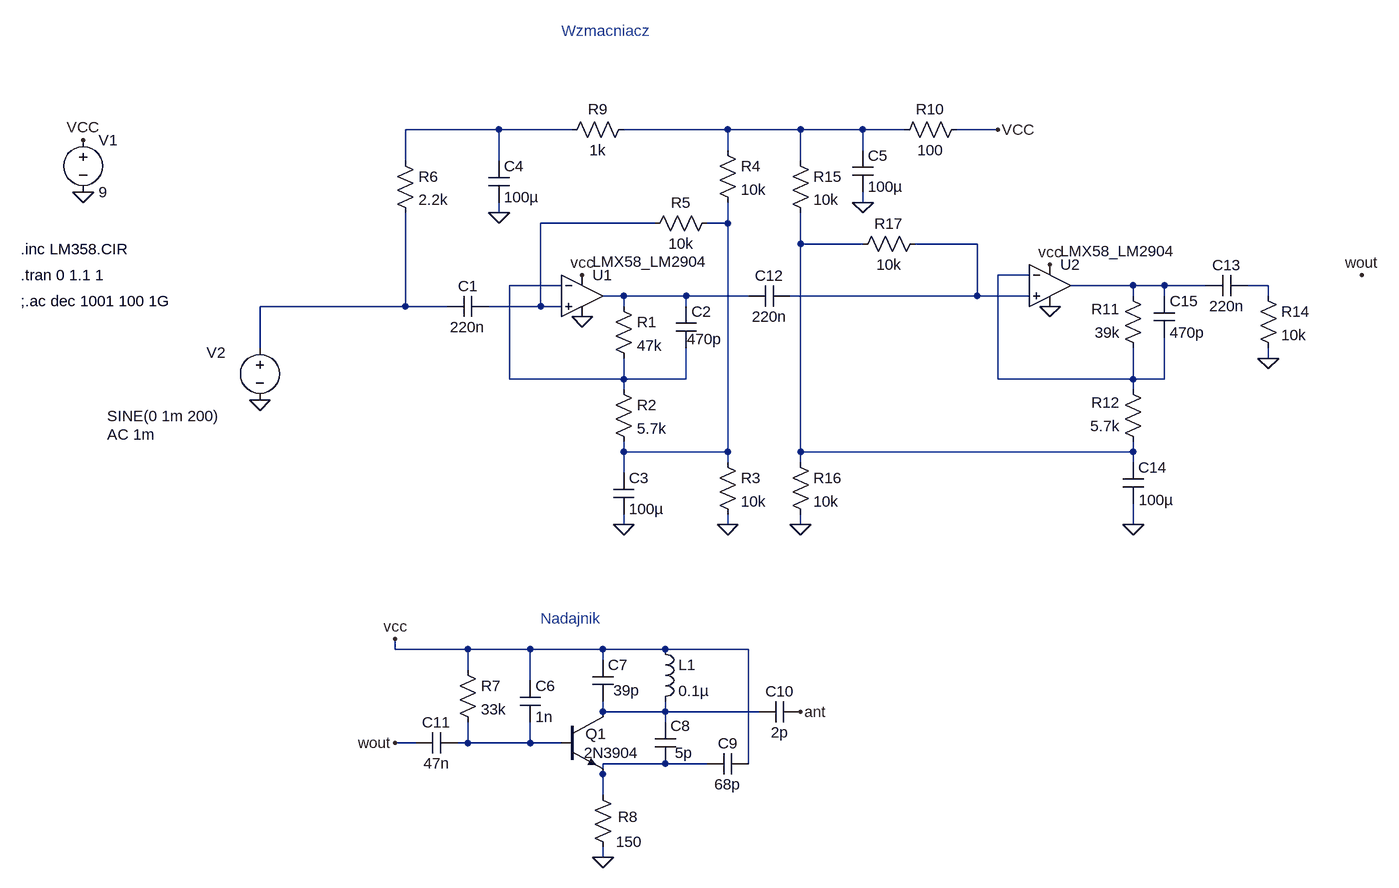
[diagram p0: schematic nadajnik.asc]
nadajnik.asc, the LTspice schematic file:
Version 4
SHEET 1 1900 1576
WIRE 496 336 352 336
WIRE 608 336 496 336
WIRE 848 336 688 336
WIRE 960 336 848 336
WIRE 1056 336 960 336
WIRE 1120 336 1056 336
WIRE 1264 336 1200 336
WIRE 848 368 848 336
WIRE 1056 368 1056 336
WIRE 352 384 352 336
WIRE 496 384 496 336
WIRE 960 384 960 336
WIRE 1056 448 1056 432
WIRE 496 464 496 448
WIRE 736 480 560 480
WIRE 848 480 848 448
WIRE 848 480 816 480
WIRE 960 512 960 464
WIRE 1056 512 960 512
WIRE 1232 512 1136 512
WIRE 1312 560 1264 560
WIRE 592 576 512 576
WIRE 1472 576 1376 576
WIRE 1520 576 1472 576
WIRE 1584 576 1520 576
WIRE 1680 576 1648 576
WIRE 688 592 656 592
WIRE 784 592 688 592
WIRE 880 592 784 592
WIRE 1232 592 1232 512
WIRE 1232 592 944 592
WIRE 1312 592 1232 592
WIRE 1472 592 1472 576
WIRE 1520 592 1520 576
WIRE 1680 592 1680 576
WIRE 352 608 352 464
WIRE 352 608 128 608
WIRE 416 608 352 608
WIRE 560 608 560 480
WIRE 560 608 480 608
WIRE 592 608 560 608
WIRE 688 608 688 592
WIRE 784 608 784 592
WIRE 128 672 128 608
WIRE 1680 688 1680 672
WIRE 512 720 512 576
WIRE 688 720 688 688
WIRE 688 720 512 720
WIRE 784 720 784 672
WIRE 784 720 688 720
WIRE 1264 720 1264 560
WIRE 1472 720 1472 672
WIRE 1472 720 1264 720
WIRE 1520 720 1520 656
WIRE 1520 720 1472 720
WIRE 688 736 688 720
WIRE 1472 736 1472 720
WIRE 688 832 688 816
WIRE 848 832 848 480
WIRE 848 832 688 832
WIRE 960 832 960 512
WIRE 1472 832 1472 816
WIRE 1472 832 960 832
WIRE 848 848 848 832
WIRE 960 848 960 832
WIRE 1472 848 1472 832
WIRE 688 864 688 832
WIRE 688 944 688 928
WIRE 848 944 848 928
WIRE 960 944 960 928
WIRE 1472 944 1472 912
WIRE 336 1136 336 1120
WIRE 448 1136 336 1136
WIRE 544 1136 448 1136
WIRE 656 1136 544 1136
WIRE 752 1136 656 1136
WIRE 880 1136 752 1136
WIRE 656 1152 656 1136
WIRE 448 1168 448 1136
WIRE 544 1184 544 1136
WIRE 656 1232 656 1216
WIRE 752 1232 752 1216
WIRE 752 1232 656 1232
WIRE 896 1232 752 1232
WIRE 752 1248 752 1232
WIRE 368 1280 336 1280
WIRE 448 1280 448 1248
WIRE 448 1280 432 1280
WIRE 544 1280 544 1248
WIRE 544 1280 448 1280
WIRE 592 1280 544 1280
WIRE 752 1312 656 1312
WIRE 816 1312 752 1312
WIRE 880 1312 880 1136
WIRE 656 1328 656 1312
WIRE 656 1360 656 1328
WIRE 656 1456 656 1440
FLAG -144 352 VCC
FLAG -144 432 0
FLAG 624 560 vcc
FLAG 624 624 0
FLAG 656 1456 0
FLAG 960 1232 ant
FLAG 336 1120 vcc
FLAG 1824 560 wout
FLAG 336 1280 wout
FLAG 128 752 0
FLAG 688 944 0
FLAG 848 944 0
FLAG 1056 448 0
FLAG 496 464 0
FLAG 1264 336 VCC
FLAG 1344 544 vcc
FLAG 1344 608 0
FLAG 1472 944 0
FLAG 1680 688 0
FLAG 960 944 0
SYMBOL voltage -144 336 R0
WINDOW 123 0 0 Left 0
WINDOW 39 0 0 Left 0
SYMATTR InstName V1
SYMATTR Value 9
SYMBOL OpAmps\\opamp2 624 528 R0
WINDOW 3 16 11 Left 2
SYMATTR Value LMX58_LM2904
SYMATTR InstName U1
SYMBOL voltage 128 656 R0
WINDOW 0 -82 23 Left 2
WINDOW 3 -235 121 Left 2
WINDOW 123 -235 149 Left 2
WINDOW 39 0 0 Left 0
SYMATTR InstName V2
SYMATTR Value SINE(0 1m 200)
SYMATTR Value2 AC 1m
SYMBOL res 432 1152 R0
SYMATTR InstName R7
SYMATTR Value 33k
SYMBOL cap 528 1184 R0
SYMATTR InstName C6
SYMATTR Value 1n
SYMBOL cap 640 1152 R0
WINDOW 3 32 47 Left 2
SYMATTR Value 39p
SYMATTR InstName C7
SYMBOL res 640 1344 R0
WINDOW 0 39 50 Left 2
WINDOW 3 36 88 Left 2
SYMATTR InstName R8
SYMATTR Value 150
SYMBOL cap 736 1248 R0
WINDOW 0 24 6 Left 2
WINDOW 3 31 47 Left 2
SYMATTR InstName C8
SYMATTR Value 5p
SYMBOL ind 736 1120 R0
SYMATTR InstName L1
SYMATTR Value 0.1µ
SYMBOL cap 880 1296 R90
WINDOW 0 0 32 VBottom 2
WINDOW 3 32 32 VTop 2
SYMATTR InstName C9
SYMATTR Value 68p
SYMBOL cap 960 1216 R90
WINDOW 0 0 32 VBottom 2
WINDOW 3 32 32 VTop 2
SYMATTR InstName C10
SYMATTR Value 2p
SYMBOL cap 432 1264 R90
WINDOW 0 0 32 VBottom 2
WINDOW 3 32 32 VTop 2
SYMATTR InstName C11
SYMATTR Value 47n
SYMBOL npn 592 1232 R0
WINDOW 0 37 34 Left 2
WINDOW 3 35 63 Left 2
SYMATTR InstName Q1
SYMATTR Value 2N3904
SYMBOL cap 480 592 R90
WINDOW 0 0 32 VBottom 2
WINDOW 3 32 32 VTop 2
SYMATTR InstName C1
SYMATTR Value 220n
SYMBOL res 672 592 R0
SYMATTR InstName R1
SYMATTR Value 47k
SYMBOL cap 768 608 R0
WINDOW 3 17 50 Left 2
SYMATTR Value 470p
SYMATTR InstName C2
SYMBOL res 672 720 R0
SYMATTR InstName R2
SYMATTR Value 5.7k
SYMBOL cap 672 864 R0
SYMATTR InstName C3
SYMATTR Value 100µ
SYMBOL res 832 832 R0
SYMATTR InstName R3
SYMATTR Value 10k
SYMBOL res 832 352 R0
SYMATTR InstName R4
SYMATTR Value 10k
SYMBOL res 832 464 R90
WINDOW 0 0 56 VBottom 2
WINDOW 3 32 56 VTop 2
SYMATTR InstName R5
SYMATTR Value 10k
SYMBOL res 336 368 R0
SYMATTR InstName R6
SYMATTR Value 2.2k
SYMBOL cap 480 384 R0
SYMATTR InstName C4
SYMATTR Value 100µ
SYMBOL res 704 320 R90
WINDOW 0 0 56 VBottom 2
WINDOW 3 32 56 VTop 2
SYMATTR InstName R9
SYMATTR Value 1k
SYMBOL cap 1040 368 R0
SYMATTR InstName C5
SYMATTR Value 100µ
SYMBOL res 1216 320 R90
WINDOW 0 0 56 VBottom 2
WINDOW 3 32 56 VTop 2
SYMATTR InstName R10
SYMATTR Value 100
SYMBOL cap 944 576 R90
WINDOW 0 0 32 VBottom 2
WINDOW 3 32 32 VTop 2
SYMATTR InstName C12
SYMATTR Value 220n
SYMBOL OpAmps\\opamp2 1344 512 R0
WINDOW 3 16 11 Left 2
SYMATTR Value LMX58_LM2904
SYMATTR InstName U2
SYMBOL res 1488 688 R180
WINDOW 0 36 76 Left 2
WINDOW 3 36 40 Left 2
SYMATTR InstName R11
SYMATTR Value 39k
SYMBOL res 1488 832 R180
WINDOW 0 36 76 Left 2
WINDOW 3 36 40 Left 2
SYMATTR InstName R12
SYMATTR Value 5.7k
SYMBOL cap 1648 560 R90
WINDOW 0 0 32 VBottom 2
WINDOW 3 32 32 VTop 2
SYMATTR InstName C13
SYMATTR Value 220n
SYMBOL res 1664 576 R0
SYMATTR InstName R14
SYMATTR Value 10k
SYMBOL cap 1456 848 R0
WINDOW 3 25 58 Left 2
SYMATTR Value 100µ
SYMATTR InstName C14
SYMBOL cap 1504 592 R0
SYMATTR InstName C15
SYMATTR Value 470p
SYMBOL res 944 368 R0
SYMATTR InstName R15
SYMATTR Value 10k
SYMBOL res 944 832 R0
SYMATTR InstName R16
SYMATTR Value 10k
SYMBOL res 1152 496 R90
WINDOW 0 0 56 VBottom 2
WINDOW 3 32 56 VTop 2
SYMATTR InstName R17
SYMATTR Value 10k
TEXT -240 520 Left 2 !.inc LM358.CIR
TEXT -240 560 Left 2 !.tran 0 1.1 1
TEXT -240 600 Left 2 !;.ac dec 1001 100 1G
TEXT 560 1088 Left 2 ;Nadajnik
TEXT 592 184 Left 2 ;Wzmacniacz

The netlist it stands for:
* nadajnik.asc
V1 VCC 0 9
XU1 N003 N008 VCC 0 N011 LMX58_LM2904  ; pins In+ In- V+ V- OUT
V2 N012 0 SINE(0 1m 200) AC 1m
R7 VCC N014 33k
C6 VCC N014 1n
C7 VCC N013 39p
R8 N015 0 150
C8 N013 N015 5p
L1 VCC N013 0.1µ
C9 VCC N015 68p
C10 ant N013 2p
C11 N014 wout 47n
Q1 N013 N014 N015 0 2N3904
C1 N003 N012 220n
R1 N011 N008 47k
C2 N011 N008 470p
R2 N008 N004 5.7k
C3 N004 0 100µ
R3 N004 0 10k
R4 N002 N004 10k
R5 N004 N003 10k
R6 N001 N012 2.2k
C4 N001 0 100µ
R9 N002 N001 1k
C5 N002 0 100µ
R10 VCC N002 100
C12 N006 N011 220n
XU2 N006 N007 VCC 0 N009 LMX58_LM2904  ; pins In+ In- V+ V- OUT
R11 N007 N009 39k
R12 N005 N007 5.7k
C13 N010 N009 220n
R14 N010 0 10k
C14 N005 0 100µ
C15 N009 N007 470p
R15 N002 N005 10k
R16 N005 0 10k
R17 N006 N005 10k
.model NPN NPN
.model PNP PNP
.lib standard.bjt
.inc LM358.CIR
.tran 0 1.1 1
;.ac dec 1001 100 1G
* Nadajnik
* Wzmacniacz
.backanno
.end